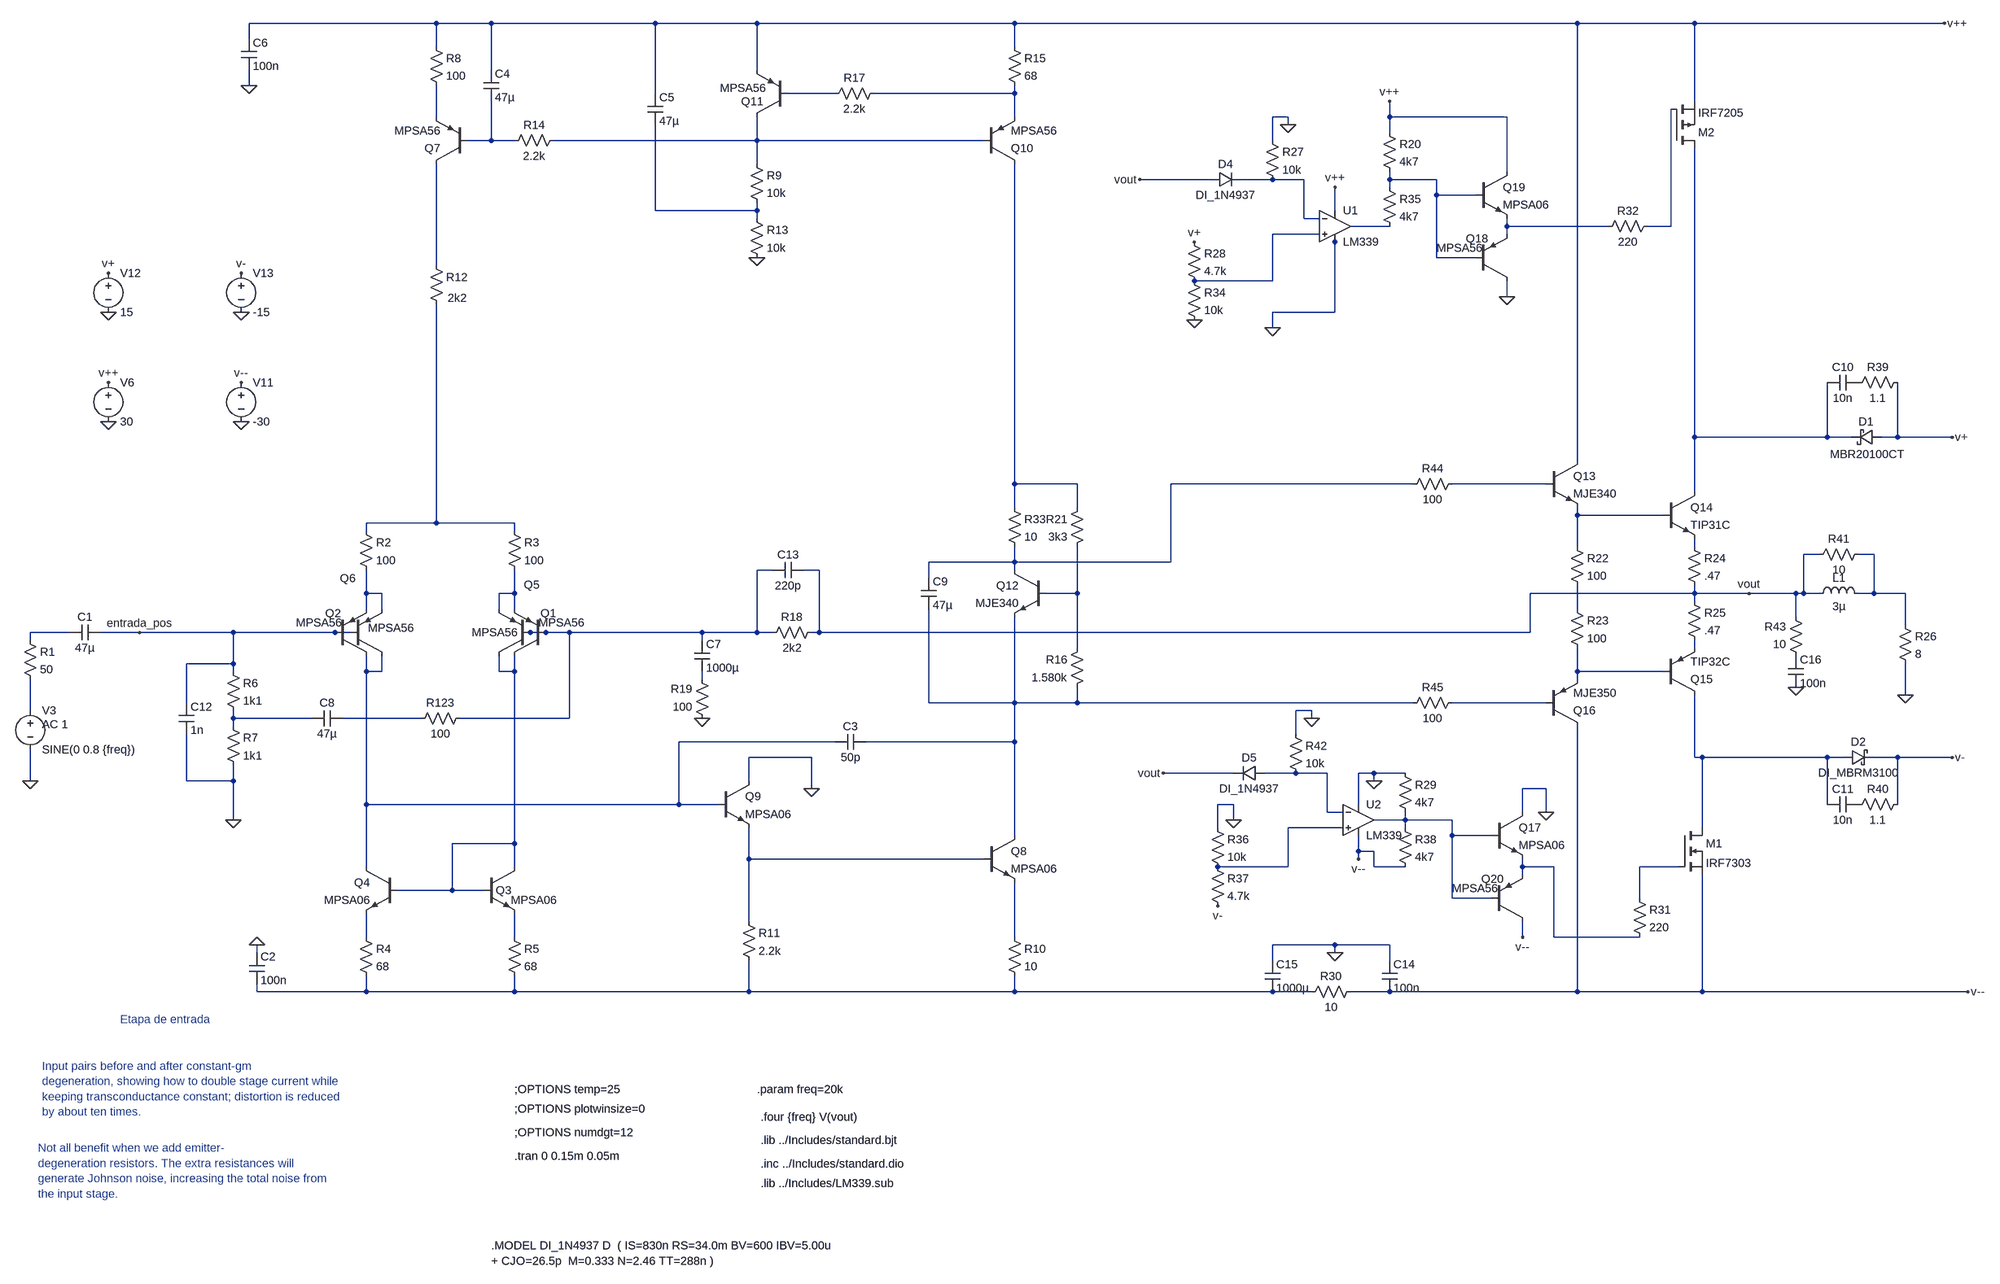
[diagram p0: schematic multiplicadorVBE_bien.asc]
multiplicadorVBE_bien.asc, the LTspice schematic file:
Version 4
SHEET 1 5124 1544
WIRE 480 -1824 96 -1824
WIRE 592 -1824 480 -1824
WIRE 928 -1824 592 -1824
WIRE 1136 -1824 928 -1824
WIRE 1664 -1824 1136 -1824
WIRE 2816 -1824 1664 -1824
WIRE 3056 -1824 2816 -1824
WIRE 3568 -1824 3056 -1824
WIRE 96 -1792 96 -1824
WIRE 480 -1776 480 -1824
WIRE 1664 -1776 1664 -1824
WIRE 592 -1728 592 -1824
WIRE 1136 -1728 1136 -1824
WIRE 96 -1696 96 -1728
WIRE 928 -1680 928 -1824
WIRE 1296 -1680 1200 -1680
WIRE 1664 -1680 1664 -1696
WIRE 1664 -1680 1376 -1680
WIRE 3056 -1664 3056 -1824
WIRE 480 -1632 480 -1696
WIRE 1664 -1632 1664 -1680
WIRE 2224 -1632 2192 -1632
WIRE 2432 -1632 2432 -1664
WIRE 2672 -1632 2432 -1632
WIRE 2224 -1616 2224 -1632
WIRE 2432 -1600 2432 -1632
WIRE 592 -1584 592 -1664
WIRE 592 -1584 544 -1584
WIRE 640 -1584 592 -1584
WIRE 1136 -1584 1136 -1632
WIRE 1136 -1584 720 -1584
WIRE 1600 -1584 1136 -1584
WIRE 2192 -1584 2192 -1632
WIRE 1136 -1536 1136 -1584
WIRE 2672 -1520 2672 -1632
WIRE 2064 -1504 1920 -1504
WIRE 2192 -1504 2128 -1504
WIRE 2256 -1504 2192 -1504
WIRE 2432 -1504 2432 -1520
WIRE 2528 -1504 2432 -1504
WIRE 2432 -1488 2432 -1504
WIRE 2528 -1472 2528 -1504
WIRE 2608 -1472 2528 -1472
WIRE 928 -1440 928 -1616
WIRE 1136 -1440 1136 -1456
WIRE 1136 -1440 928 -1440
WIRE 2320 -1440 2320 -1488
WIRE 1136 -1424 1136 -1440
WIRE 2256 -1424 2256 -1504
WIRE 2288 -1424 2256 -1424
WIRE 2432 -1408 2352 -1408
WIRE 2672 -1408 2672 -1424
WIRE 2880 -1408 2672 -1408
WIRE 3008 -1408 3008 -1648
WIRE 3008 -1408 2960 -1408
WIRE 2288 -1392 2192 -1392
WIRE 2672 -1392 2672 -1408
WIRE 2320 -1376 2320 -1392
WIRE 2528 -1344 2528 -1472
WIRE 2608 -1344 2528 -1344
WIRE 480 -1328 480 -1536
WIRE 2192 -1296 2192 -1392
WIRE 2192 -1296 2032 -1296
WIRE 2672 -1264 2672 -1296
WIRE 2320 -1232 2320 -1376
WIRE 2320 -1232 2192 -1232
WIRE 2192 -1200 2192 -1232
WIRE 3056 -976 3056 -1568
WIRE 3328 -976 3328 -1088
WIRE 3328 -976 3056 -976
WIRE 3376 -976 3328 -976
WIRE 3472 -976 3472 -1088
WIRE 3472 -976 3440 -976
WIRE 3584 -976 3472 -976
WIRE 2816 -928 2816 -1824
WIRE 1664 -880 1664 -1536
WIRE 1792 -880 1664 -880
WIRE 2480 -880 1984 -880
WIRE 2752 -880 2560 -880
WIRE 3056 -864 3056 -976
WIRE 1664 -832 1664 -880
WIRE 1792 -832 1792 -880
WIRE 2816 -816 2816 -832
WIRE 2992 -816 2816 -816
WIRE 480 -800 480 -1248
WIRE 480 -800 336 -800
WIRE 640 -800 480 -800
WIRE 336 -784 336 -800
WIRE 640 -784 640 -800
WIRE 2816 -752 2816 -816
WIRE 3056 -752 3056 -768
WIRE 3312 -736 3280 -736
WIRE 3424 -736 3392 -736
WIRE 1664 -720 1664 -752
WIRE 1664 -720 1488 -720
WIRE 1984 -720 1984 -880
WIRE 1984 -720 1664 -720
WIRE 1168 -704 1136 -704
WIRE 1264 -704 1232 -704
WIRE 1664 -704 1664 -720
WIRE 1488 -688 1488 -720
WIRE 336 -656 336 -704
WIRE 368 -656 336 -656
WIRE 640 -656 640 -704
WIRE 640 -656 608 -656
WIRE 1792 -656 1792 -752
WIRE 1792 -656 1728 -656
WIRE 3056 -656 3056 -672
WIRE 3056 -656 2720 -656
WIRE 3168 -656 3056 -656
WIRE 3264 -656 3168 -656
WIRE 3280 -656 3280 -736
WIRE 3280 -656 3264 -656
WIRE 3312 -656 3280 -656
WIRE 3424 -656 3424 -736
WIRE 3424 -656 3392 -656
WIRE 3488 -656 3424 -656
WIRE 3056 -640 3056 -656
WIRE 336 -624 336 -656
WIRE 368 -624 368 -656
WIRE 608 -624 608 -656
WIRE 640 -624 640 -656
WIRE 2816 -624 2816 -672
WIRE 3264 -608 3264 -656
WIRE 3488 -592 3488 -656
WIRE -272 -576 -352 -576
WIRE -128 -576 -208 -576
WIRE 64 -576 -128 -576
WIRE 272 -576 64 -576
WIRE 304 -576 272 -576
WIRE 672 -576 656 -576
WIRE 704 -576 672 -576
WIRE 752 -576 704 -576
WIRE 1024 -576 752 -576
WIRE 1136 -576 1136 -704
WIRE 1136 -576 1024 -576
WIRE 1168 -576 1136 -576
WIRE 1264 -576 1264 -704
WIRE 1264 -576 1248 -576
WIRE 2720 -576 2720 -656
WIRE 2720 -576 1264 -576
WIRE -352 -560 -352 -576
WIRE 1024 -560 1024 -576
WIRE 1792 -544 1792 -656
WIRE 3056 -544 3056 -560
WIRE 64 -512 64 -576
WIRE 64 -512 -32 -512
WIRE 64 -496 64 -512
WIRE 336 -496 336 -528
WIRE 368 -496 368 -528
WIRE 368 -496 336 -496
WIRE 608 -496 608 -528
WIRE 640 -496 640 -528
WIRE 640 -496 608 -496
WIRE 2816 -496 2816 -544
WIRE 2992 -496 2816 -496
WIRE 1024 -480 1024 -496
WIRE 2816 -480 2816 -496
WIRE 3488 -448 3488 -512
WIRE -32 -432 -32 -512
WIRE 1488 -432 1488 -624
WIRE 1664 -432 1664 -608
WIRE 1664 -432 1488 -432
WIRE 1792 -432 1792 -464
WIRE 1792 -432 1664 -432
WIRE 2480 -432 1792 -432
WIRE 2752 -432 2560 -432
WIRE -352 -416 -352 -480
WIRE 2272 -416 2240 -416
WIRE 64 -400 64 -416
WIRE 224 -400 64 -400
WIRE 448 -400 288 -400
WIRE 752 -400 752 -576
WIRE 752 -400 528 -400
WIRE 2272 -400 2272 -416
WIRE 64 -384 64 -400
WIRE 2240 -368 2240 -416
WIRE 1296 -352 976 -352
WIRE 1664 -352 1664 -432
WIRE 1664 -352 1360 -352
WIRE 1248 -320 1120 -320
WIRE 3056 -320 3056 -448
WIRE 3072 -320 3056 -320
WIRE 3328 -320 3072 -320
WIRE 3360 -320 3328 -320
WIRE 3472 -320 3424 -320
WIRE 3584 -320 3472 -320
WIRE 2112 -288 1968 -288
WIRE 2240 -288 2176 -288
WIRE 2304 -288 2240 -288
WIRE 2400 -288 2368 -288
WIRE 2464 -288 2400 -288
WIRE -352 -272 -352 -336
WIRE -32 -272 -32 -368
WIRE 64 -272 64 -304
WIRE 64 -272 -32 -272
WIRE 1120 -272 1120 -320
WIRE 2400 -272 2400 -288
WIRE 1248 -256 1248 -320
WIRE 2752 -256 2704 -256
WIRE 336 -224 336 -496
WIRE 976 -224 976 -352
WIRE 976 -224 336 -224
WIRE 1056 -224 976 -224
WIRE 2112 -224 2080 -224
WIRE 2368 -224 2368 -288
WIRE 3328 -224 3328 -320
WIRE 3472 -224 3472 -320
WIRE 2304 -208 2304 -288
WIRE 2336 -208 2304 -208
WIRE 2704 -208 2704 -256
WIRE 2752 -208 2752 -256
WIRE 64 -192 64 -272
WIRE 2112 -192 2112 -224
WIRE 2464 -192 2464 -208
WIRE 2464 -192 2400 -192
WIRE 2560 -192 2464 -192
WIRE 2080 -176 2080 -224
WIRE 2336 -176 2224 -176
WIRE 2464 -176 2464 -192
WIRE 3072 -176 3072 -320
WIRE 1664 -160 1664 -352
WIRE 2560 -160 2560 -192
WIRE 2640 -160 2560 -160
WIRE 640 -144 640 -496
WIRE 640 -144 512 -144
WIRE 2368 -128 2368 -160
WIRE 2400 -128 2368 -128
WIRE 1120 -112 1120 -176
WIRE 1600 -112 1120 -112
WIRE 2368 -112 2368 -128
WIRE 336 -96 336 -224
WIRE 640 -96 640 -144
WIRE 2224 -96 2224 -176
WIRE 2224 -96 2080 -96
WIRE 2400 -96 2400 -128
WIRE 2464 -96 2400 -96
WIRE 2704 -96 2704 -112
WIRE 2768 -96 2704 -96
WIRE 3024 -96 2944 -96
WIRE 2704 -80 2704 -96
WIRE 512 -48 512 -144
WIRE 512 -48 400 -48
WIRE 576 -48 512 -48
WIRE 2560 -32 2560 -160
WIRE 2640 -32 2560 -32
WIRE 2944 -32 2944 -96
WIRE 1120 16 1120 -112
WIRE 336 48 336 0
WIRE 640 48 640 0
WIRE 1664 48 1664 -64
WIRE 2704 48 2704 16
WIRE 2768 48 2768 -96
WIRE 2944 48 2768 48
WIRE 2320 64 2192 64
WIRE 2432 64 2320 64
WIRE 112 80 112 64
WIRE 2320 80 2320 64
WIRE 2192 96 2192 64
WIRE 2432 96 2432 64
WIRE 112 160 112 144
WIRE 336 160 336 128
WIRE 336 160 112 160
WIRE 640 160 640 128
WIRE 640 160 336 160
WIRE 1120 160 1120 96
WIRE 1120 160 640 160
WIRE 1664 160 1664 128
WIRE 1664 160 1120 160
WIRE 2192 160 1664 160
WIRE 2272 160 2192 160
WIRE 2432 160 2352 160
WIRE 2816 160 2816 -384
WIRE 2816 160 2432 160
WIRE 3072 160 3072 -80
WIRE 3072 160 2816 160
WIRE 3616 160 3072 160
FLAG 64 -192 0
FLAG -352 -272 0
FLAG -128 -576 entrada_pos
FLAG 112 64 0
FLAG 1136 -1344 0
FLAG 96 -1696 0
FLAG 1248 -256 0
FLAG 1024 -400 0
FLAG 3488 -448 0
FLAG 3168 -656 vout
FLAG 2192 -1200 0
FLAG 2672 -1264 0
FLAG 80 -1232 0
FLAG -192 -1232 0
FLAG -192 -1008 0
FLAG 80 -1008 0
FLAG -192 -1088 v++
FLAG 80 -1088 v--
FLAG 80 -1312 v-
FLAG -192 -1312 v+
FLAG 3568 -1824 v++
FLAG 3584 -976 v+
FLAG 3584 -320 v-
FLAG 3616 160 v--
FLAG 2320 -1488 v++
FLAG 2432 -1664 v++
FLAG 2032 -1216 0
FLAG 2032 -1376 v+
FLAG 2752 -208 0
FLAG 2704 48 v--
FLAG 2080 -16 v-
FLAG 2112 -192 0
FLAG 2400 -272 0
FLAG 2368 -112 v--
FLAG 1968 -288 vout
FLAG 2272 -400 0
FLAG 1920 -1504 vout
FLAG 2224 -1616 0
FLAG 2320 80 0
FLAG 3264 -464 0
SYMBOL pnp 704 -528 R180
WINDOW 0 -21 87 Left 2
WINDOW 3 -79 68 Left 2
SYMATTR InstName Q1
SYMATTR Value MPSA56
SYMBOL pnp 272 -528 M180
WINDOW 0 -20 87 Left 2
WINDOW 3 -80 68 Left 2
SYMATTR InstName Q2
SYMATTR Value MPSA56
SYMBOL res -368 -576 R0
SYMATTR InstName R1
SYMATTR Value 50
SYMBOL cap -208 -592 R90
WINDOW 0 0 32 VBottom 2
WINDOW 3 32 32 VTop 2
SYMATTR InstName C1
SYMATTR Value 47µ
SYMBOL npn 576 -96 R0
WINDOW 0 25 48 Left 2
SYMATTR InstName Q3
SYMATTR Value MPSA06
SYMBOL npn 400 -96 M0
SYMATTR InstName Q4
SYMATTR Value MPSA06
SYMBOL res 320 -800 R0
SYMATTR InstName R2
SYMATTR Value 100
SYMBOL res 624 -800 R0
SYMATTR InstName R3
SYMATTR Value 100
SYMBOL res 320 32 R0
SYMATTR InstName R4
SYMATTR Value 68
SYMBOL res 624 32 R0
SYMATTR InstName R5
SYMATTR Value 68
SYMBOL cap 96 80 R0
SYMATTR InstName C2
SYMATTR Value 100n
SYMBOL pnp 672 -528 R180
WINDOW 0 -19 146 Left 2
WINDOW 3 25 48 Left 2
SYMATTR InstName Q5
SYMATTR Value MPSA56
SYMBOL pnp 304 -528 M180
WINDOW 0 -22 159 Left 2
WINDOW 3 36 57 Left 2
SYMATTR InstName Q6
SYMATTR Value MPSA56
SYMBOL res 464 -1792 R0
SYMATTR InstName R8
SYMATTR Value 100
SYMBOL pnp 544 -1536 R180
SYMATTR InstName Q7
SYMATTR Value MPSA56
SYMBOL res 1120 -1552 R0
SYMATTR InstName R9
SYMATTR Value 10k
SYMBOL res 464 -1344 R0
WINDOW 3 39 83 Left 2
SYMATTR Value 2k2
SYMATTR InstName R12
SYMBOL cap 576 -1728 R0
SYMATTR InstName C4
SYMATTR Value 47µ
SYMBOL res 1120 -1440 R0
SYMATTR InstName R13
SYMATTR Value 10k
SYMBOL cap 912 -1680 R0
SYMATTR InstName C5
SYMATTR Value 47µ
SYMBOL cap 80 -1792 R0
SYMATTR InstName C6
SYMATTR Value 100n
SYMBOL res 736 -1600 R90
WINDOW 0 0 56 VBottom 2
WINDOW 3 32 56 VTop 2
SYMATTR InstName R14
SYMATTR Value 2.2k
SYMBOL res 1648 32 R0
SYMATTR InstName R10
SYMATTR Value 10
SYMBOL npn 1600 -160 R0
SYMATTR InstName Q8
SYMATTR Value MPSA06
SYMBOL npn 1056 -272 R0
SYMATTR InstName Q9
SYMATTR Value MPSA06
SYMBOL res 1104 0 R0
SYMATTR InstName R11
SYMATTR Value 2.2k
SYMBOL res 1648 -1792 R0
SYMATTR InstName R15
SYMATTR Value 68
SYMBOL pnp 1600 -1536 M180
SYMATTR InstName Q10
SYMATTR Value MPSA56
SYMBOL pnp 1200 -1632 R180
WINDOW 0 50 32 Left 2
WINDOW 3 45 59 Left 2
SYMATTR InstName Q11
SYMATTR Value MPSA56
SYMBOL res 1392 -1696 R90
WINDOW 0 0 56 VBottom 2
WINDOW 3 32 56 VTop 2
SYMATTR InstName R17
SYMATTR Value 2.2k
SYMBOL res 1264 -592 R90
WINDOW 0 0 56 VBottom 2
WINDOW 3 32 56 VTop 2
SYMATTR InstName R18
SYMATTR Value 2k2
SYMBOL res 1040 -384 R180
WINDOW 0 36 76 Left 2
WINDOW 3 36 40 Left 2
SYMATTR InstName R19
SYMATTR Value 100
SYMBOL cap 1008 -560 R0
SYMATTR InstName C7
SYMATTR Value 1000µ
SYMBOL voltage -352 -432 R0
WINDOW 123 24 44 Left 2
WINDOW 39 0 0 Left 0
SYMATTR Value2 AC 1
SYMATTR InstName V3
SYMATTR Value SINE(0 0.8 {freq})
SYMBOL cap 1360 -368 R90
WINDOW 0 0 32 VBottom 2
WINDOW 3 32 32 VTop 2
SYMATTR InstName C3
SYMATTR Value 50p
SYMBOL res 48 -512 R0
SYMATTR InstName R6
SYMATTR Value 1k1
SYMBOL res 48 -400 R0
SYMATTR InstName R7
SYMATTR Value 1k1
SYMBOL cap 288 -416 R90
WINDOW 0 0 32 VBottom 2
WINDOW 3 32 32 VTop 2
SYMATTR InstName C8
SYMATTR Value 47µ
SYMBOL res 544 -416 R90
WINDOW 0 0 56 VBottom 2
WINDOW 3 32 56 VTop 2
SYMATTR InstName R123
SYMATTR Value 100
SYMBOL npn 1728 -704 M0
SYMATTR InstName Q12
SYMATTR Value MJE340
SYMBOL res 1808 -560 M0
SYMATTR InstName R16
SYMATTR Value 1.580k
SYMBOL res 1808 -848 M0
SYMATTR InstName R21
SYMATTR Value 3k3
SYMBOL npn 2752 -928 R0
SYMATTR InstName Q13
SYMATTR Value MJE340
SYMBOL npn 2992 -864 R0
SYMATTR InstName Q14
SYMATTR Value TIP31C
SYMBOL pnp 2992 -448 M180
SYMATTR InstName Q15
SYMATTR Value TIP32C
SYMBOL pnp 2752 -384 M180
SYMATTR InstName Q16
SYMATTR Value MJE350
SYMBOL res 2800 -768 R0
SYMATTR InstName R22
SYMATTR Value 100
SYMBOL res 2800 -640 R0
SYMATTR InstName R23
SYMATTR Value 100
SYMBOL res 3040 -768 R0
SYMATTR InstName R24
SYMATTR Value .47
SYMBOL res 3040 -656 R0
SYMATTR InstName R25
SYMATTR Value .47
SYMBOL res 3472 -608 R0
SYMATTR InstName R26
SYMATTR Value 8
SYMBOL schottky 3440 -992 R90
WINDOW 0 0 32 VBottom 2
WINDOW 3 35 30 VTop 2
SYMATTR InstName D1
SYMATTR Value MBR20100CT
SYMATTR Description Diode
SYMATTR Type diode
SYMBOL Opamps\\opamp2 2320 -1472 R0
SYMATTR InstName U1
SYMATTR Value LM339
SYMBOL schottky 3360 -304 R270
WINDOW 0 32 32 VTop 2
WINDOW 3 0 32 VBottom 2
SYMATTR InstName D2
SYMATTR Value DI_MBRM3100
SYMATTR Description Diode
SYMATTR Type diode
SYMBOL nmos 3024 -176 R0
SYMATTR InstName M1
SYMATTR Value IRF7303
SYMBOL pmos 3008 -1568 M180
SYMATTR InstName M2
SYMATTR Value IRF7205
SYMBOL res 2928 -48 R0
SYMATTR InstName R31
SYMATTR Value 220
SYMBOL res 2976 -1424 R90
WINDOW 0 0 56 VBottom 2
WINDOW 3 32 56 VTop 2
SYMATTR InstName R32
SYMATTR Value 220
SYMBOL cap 1472 -688 R0
SYMATTR InstName C9
SYMATTR Value 47µ
SYMBOL res 1648 -848 R0
SYMATTR InstName R33
SYMATTR Value 10
SYMBOL voltage -192 -1104 R0
WINDOW 123 0 0 Left 0
WINDOW 39 0 0 Left 0
SYMATTR InstName V6
SYMATTR Value 30
SYMBOL voltage 80 -1104 R0
WINDOW 123 0 0 Left 0
WINDOW 39 0 0 Left 0
SYMATTR InstName V11
SYMATTR Value -30
SYMBOL voltage -192 -1328 R0
WINDOW 123 0 0 Left 0
WINDOW 39 0 0 Left 0
SYMATTR InstName V12
SYMATTR Value 15
SYMBOL voltage 80 -1328 R0
WINDOW 123 0 0 Left 0
WINDOW 39 0 0 Left 0
SYMATTR InstName V13
SYMATTR Value -15
SYMBOL pnp 2608 -1296 M180
WINDOW 0 -20 87 Left 2
WINDOW 3 -80 68 Left 2
SYMATTR InstName Q18
SYMATTR Value MPSA56
SYMBOL res 2416 -1616 R0
SYMATTR InstName R20
SYMATTR Value 4k7
SYMBOL res 2016 -1392 R0
SYMATTR InstName R28
SYMATTR Value 4.7k
SYMBOL res 2016 -1312 R0
SYMATTR InstName R34
SYMATTR Value 10k
SYMBOL res 2416 -1504 R0
SYMATTR InstName R35
SYMATTR Value 4k7
SYMBOL Opamps\\opamp2 2368 -256 R0
SYMATTR InstName U2
SYMATTR Value LM339
SYMBOL pnp 2640 16 M180
WINDOW 0 -20 87 Left 2
WINDOW 3 -80 68 Left 2
SYMATTR InstName Q20
SYMATTR Value MPSA56
SYMBOL res 2448 -304 R0
SYMATTR InstName R29
SYMATTR Value 4k7
SYMBOL res 2064 -192 R0
SYMATTR InstName R36
SYMATTR Value 10k
SYMBOL res 2064 -112 R0
SYMATTR InstName R37
SYMATTR Value 4.7k
SYMBOL res 2448 -192 R0
SYMATTR InstName R38
SYMATTR Value 4k7
SYMBOL cap 3392 -1104 R90
WINDOW 0 0 32 VBottom 2
WINDOW 3 32 32 VTop 2
SYMATTR InstName C10
SYMATTR Value 10n
SYMBOL res 3488 -1104 R90
WINDOW 0 0 56 VBottom 2
WINDOW 3 32 56 VTop 2
SYMATTR InstName R39
SYMATTR Value 1.1
SYMBOL cap 3392 -240 R90
WINDOW 0 0 32 VBottom 2
WINDOW 3 32 32 VTop 2
SYMATTR InstName C11
SYMATTR Value 10n
SYMBOL res 3488 -240 R90
WINDOW 0 0 56 VBottom 2
WINDOW 3 32 56 VTop 2
SYMATTR InstName R40
SYMATTR Value 1.1
SYMBOL npn 2640 -208 R0
SYMATTR InstName Q17
SYMATTR Value MPSA06
SYMBOL npn 2608 -1520 R0
SYMATTR InstName Q19
SYMATTR Value MPSA06
SYMBOL cap -48 -432 R0
SYMATTR InstName C12
SYMATTR Value 1n
SYMBOL diode 2176 -304 R90
WINDOW 0 0 32 VBottom 2
WINDOW 3 32 32 VTop 2
SYMATTR InstName D5
SYMATTR Value DI_1N4937
SYMBOL res 2224 -384 R0
SYMATTR InstName R42
SYMATTR Value 10k
SYMBOL diode 2064 -1488 R270
WINDOW 0 32 32 VTop 2
WINDOW 3 0 32 VBottom 2
SYMATTR InstName D4
SYMATTR Value DI_1N4937
SYMBOL res 2176 -1600 R0
SYMATTR InstName R27
SYMATTR Value 10k
SYMBOL cap 1232 -720 R90
WINDOW 0 0 32 VBottom 2
WINDOW 3 32 32 VTop 2
SYMATTR InstName C13
SYMATTR Value 220p
SYMBOL cap 2416 96 R0
SYMATTR InstName C14
SYMATTR Value 100n
SYMBOL res 2368 144 R90
WINDOW 0 0 56 VBottom 2
WINDOW 3 32 56 VTop 2
SYMATTR InstName R30
SYMATTR Value 10
SYMBOL cap 2176 96 R0
SYMATTR InstName C15
SYMATTR Value 1000µ
SYMBOL ind 3296 -640 R270
WINDOW 0 32 56 VTop 2
WINDOW 3 5 56 VBottom 2
SYMATTR InstName L1
SYMATTR Value 3µ
SYMBOL res 3408 -752 R90
WINDOW 0 0 56 VBottom 2
WINDOW 3 32 56 VTop 2
SYMATTR InstName R41
SYMATTR Value 10
SYMBOL res 3280 -512 R180
WINDOW 0 36 76 Left 2
WINDOW 3 36 40 Left 2
SYMATTR InstName R43
SYMATTR Value 10
SYMBOL cap 3248 -528 R0
SYMATTR InstName C16
SYMATTR Value 100n
SYMBOL res 2576 -896 R90
WINDOW 0 0 56 VBottom 2
WINDOW 3 32 56 VTop 2
SYMATTR InstName R44
SYMATTR Value 100
SYMBOL res 2576 -448 R90
WINDOW 0 0 56 VBottom 2
WINDOW 3 32 56 VTop 2
SYMATTR InstName R45
SYMATTR Value 100
TEXT 1144 464 Left 2 !.lib ../Includes/standard.bjt
TEXT 640 496 Left 2 !.tran 0 0.15m 0.05m
TEXT 1144 512 Left 2 !.inc ../Includes/standard.dio
TEXT 1144 416 Left 2 !.four {freq} V(vout)
TEXT 1136 360 Left 2 !.param freq=20k
TEXT -328 312 Left 2 ;Input pairs before and after constant-gm\ndegeneration, showing how to double stage current while\nkeeping transconductance constant; distortion is reduced\nby about ten times.
TEXT -336 480 Left 2 ;Not all benefit when we add emitter-\ndegeneration resistors. The extra resistances will\ngenerate Johnson noise, increasing the total noise from\nthe input stage.
TEXT -168 216 Left 2 ;Etapa de entrada
TEXT 640 400 Left 2 !;OPTIONS plotwinsize=0
TEXT 640 448 Left 2 !;OPTIONS numdgt=12
TEXT 640 360 Left 2 !;OPTIONS temp=25
TEXT 1144 552 Left 2 !.lib ../Includes/LM339.sub
TEXT 592 680 Left 2 !.MODEL DI_1N4937 D  ( IS=830n RS=34.0m BV=600 IBV=5.00u\n+ CJO=26.5p  M=0.333 N=2.46 TT=288n )

The netlist it stands for:
* multiplicadorVBE_bien.asc
Q1 N030 N022 N024 0 MPSA56
Q2 N029 entrada_pos N023 0 MPSA56
R1 N027 N035 50
C1 entrada_pos N027 47µ
Q3 N030 N030 N046 0 MPSA06
Q4 N029 N030 N045 0 MPSA06
R2 N019 N023 100
R3 N019 N024 100
R4 N045 N048 68
R5 N046 N048 68
C2 0 N048 100n
Q5 N030 N022 N024 0 MPSA56
Q6 N029 entrada_pos N023 0 MPSA56
R8 v++ N003 100
Q7 N013 N004 N003 0 MPSA56
R9 N005 N008 10k
R12 N013 N019 2k2
C4 v++ N004 47µ
R13 N008 0 10k
C5 v++ N008 47µ
C6 v++ 0 100n
R14 N005 N004 2.2k
R10 N047 N048 10
Q8 N033 N042 N047 0 MPSA06
Q9 0 N029 N042 0 MPSA06
R11 N042 N048 2.2k
R15 v++ N002 68
Q10 N015 N005 N002 0 MPSA56
Q11 N005 N001 v++ 0 MPSA56
R17 N002 N001 2.2k
R18 vout N022 2k2
R19 0 N032 100
C7 N022 N032 1000µ
V3 N035 0 SINE(0 0.8 {freq}) AC 1
C3 N033 N029 50p
R6 entrada_pos N036 1k1
R7 N036 0 1k1
C8 N037 N036 47µ
R123 N022 N037 100
Q12 N016 N025 N033 0 MJE340
R16 N025 N033 1.580k
R21 N015 N025 3k3
Q13 v++ N017 N018 0 MJE340
Q14 N014 N018 N020 0 TIP31C
Q15 N038 N031 N028 0 TIP32C
Q16 v-- N034 N031 0 MJE350
R22 N018 N026 100
R23 N026 N031 100
R24 N020 vout .47
R25 vout N028 .47
R26 N021 0 8
D1 v+ N014 MBR20100CT
XU1 N012 N006 v++ 0 N009 LM339  ; pins In+ In- V+ V- OUT
D2 N038 v- DI_MBRM3100
M1 N038 N044 v-- v-- IRF7303
M2 N014 N011 v++ v++ IRF7205
R31 N044 N043 220
R32 N011 N010 220
C9 N016 N033 47µ
R33 N015 N016 10
V6 v++ 0 30
V11 v-- 0 -30
V12 v+ 0 15
V13 v- 0 -15
Q18 0 N007 N010 0 MPSA56
R20 v++ N007 4k7
R28 v+ N012 4.7k
R34 N012 0 10k
R35 N007 N009 4k7
XU2 N041 N039 0 v-- N040 LM339  ; pins In+ In- V+ V- OUT
Q20 v-- N040 N043 0 MPSA56
R29 0 N040 4k7
R36 0 N041 10k
R37 N041 v- 4.7k
R38 N040 v-- 4k7
C10 P001 N014 10n
R39 v+ P001 1.1
C11 P002 N038 10n
R40 v- P002 1.1
Q17 0 N040 N043 0 MPSA06
Q19 v++ N007 N010 0 MPSA06
C12 entrada_pos 0 1n
D5 N039 vout DI_1N4937
R42 0 N039 10k
D4 vout N006 DI_1N4937
R27 0 N006 10k
C13 vout N022 220p
C14 0 v-- 100n
R30 v-- N048 10
C15 0 N048 1000µ
L1 vout N021 3µ
R41 N021 vout 10
R43 P003 vout 10
C16 P003 0 100n
R44 N017 N016 100
R45 N034 N033 100
.model D D
.lib standard.dio
.model NPN NPN
.model PNP PNP
.lib standard.bjt
.model NMOS NMOS
.model PMOS PMOS
.lib standard.mos
.lib ../Includes/standard.bjt
.tran 0 0.15m 0.05m
.inc ../Includes/standard.dio
.four {freq} V(vout)
.param freq=20k
* Input pairs before and after constant-gm
* degeneration, showing how to double stage current while
* keeping transconductance constant; distortion is reduced
* by about ten times.
* Not all benefit when we add emitter-
* degeneration resistors. The extra resistances will
* generate Johnson noise, increasing the total noise from
* the input stage.
* Etapa de entrada
;OPTIONS plotwinsize=0
;OPTIONS numdgt=12
;OPTIONS temp=25
.lib ../Includes/LM339.sub
.MODEL DI_1N4937 D  ( IS=830n RS=34.0m BV=600 IBV=5.00u
+ CJO=26.5p  M=0.333 N=2.46 TT=288n )
.backanno
.end